# EAGLE schematic controle (EAGLE 6.5.0)
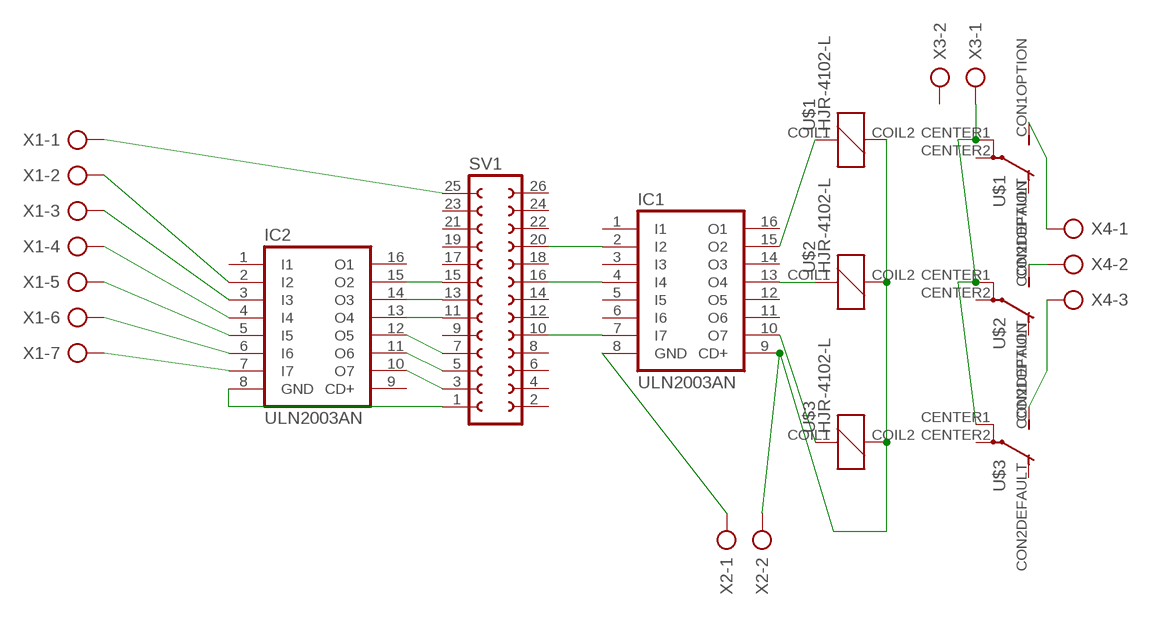
[diagram p0: schematic, sheet 1]

## Parts
IC1  ULN2003AN  [DIL16]
IC2  ULN2003AN  [DIL16]
SV1  FE13-2  [FE13-2]
U$1  HJR-4102-L  [HJR4102]
U$2  HJR-4102-L  [HJR4102]
U$3  HJR-4102-L  [HJR4102]
X1  AK500/7  [AK500/7]
X2  AK500/2  [AK500/2]
X3  AK500/2  [AK500/2]
X4  AK500/3  [AK500/3]

## Nets
N$1: IC2.8(GND) SV1.1
N$2: IC2.10(O7) SV1.3
N$3: IC2.11(O6) SV1.5
N$4: IC2.12(O5) SV1.7
N$5: IC2.13(O4) SV1.11
N$6: IC2.14(O3) SV1.13
N$7: IC2.15(O2) SV1.15
N$8: SV1.25 X1.1
N$9: IC2.2(I2) X1.2
N$10: IC2.3(I3) X1.3
N$11: IC2.4(I4) X1.4
N$12: IC2.5(I5) X1.5
N$13: IC2.6(I6) X1.6
N$14: IC2.7(I7) X1.7
N$15: IC1.7(I7) SV1.10
N$16: IC1.13(O4) U$2.COIL1
N$17: IC1.2(I2) SV1.20
N$18: IC1.4(I4) SV1.16
N$21: IC1.10(O7) U$3.COIL1
N$22: IC1.15(O2) U$1.COIL1
N$23: IC1.8(GND) X2.1
N$24: IC1.9(CD+) U$1.COIL2 U$2.COIL2 U$3.COIL2 X2.2
N$27: U$1.CENTER1(P) U$2.CENTER1(P) U$3.CENTER1(P) X3.1
N$28: U$2.CON1OPTION(S) X4.2
N$29: U$1.CON1OPTION(S) X4.1
N$30: U$3.CON1OPTION(S) X4.3
Unconnected: IC1.1(I1) IC1.3(I3) IC1.5(I5) IC1.6(I6) IC1.11(O6) IC1.12(O5) IC1.14(O3) IC1.16(O1) IC2.1(I1) IC2.9(CD+) IC2.16(O1) SV1.2 SV1.4 SV1.6 SV1.8 SV1.9 SV1.12 SV1.14 SV1.17 SV1.18 SV1.19 SV1.21 SV1.22 SV1.23 SV1.24 SV1.26 U$1.CENTER2(P) U$1.CON2DEFAULT(O) U$2.CENTER2(P) U$2.CON2DEFAULT(O) U$3.CENTER2(P) U$3.CON2DEFAULT(O) X3.2

## Library data of the parts
IC1 IC2 = uln-udn:ULN2003A: DRIVER ARRAY
SV1 = con-lsta:FE13-2: FEMALE HEADER; OC_FARNELL: unknown; OC_NEWARK: unknown
U$1-U$3 = relay:HJR-4102-L
X1 = con-ptr500:AK500/7: CONNECTOR; OC_FARNELL: unknown; OC_NEWARK: unknown
X2 X3 = con-ptr500:AK500/2: CONNECTOR; OC_FARNELL: unknown; OC_NEWARK: unknown
X4 = con-ptr500:AK500/3: CONNECTOR; OC_FARNELL: unknown; OC_NEWARK: unknown